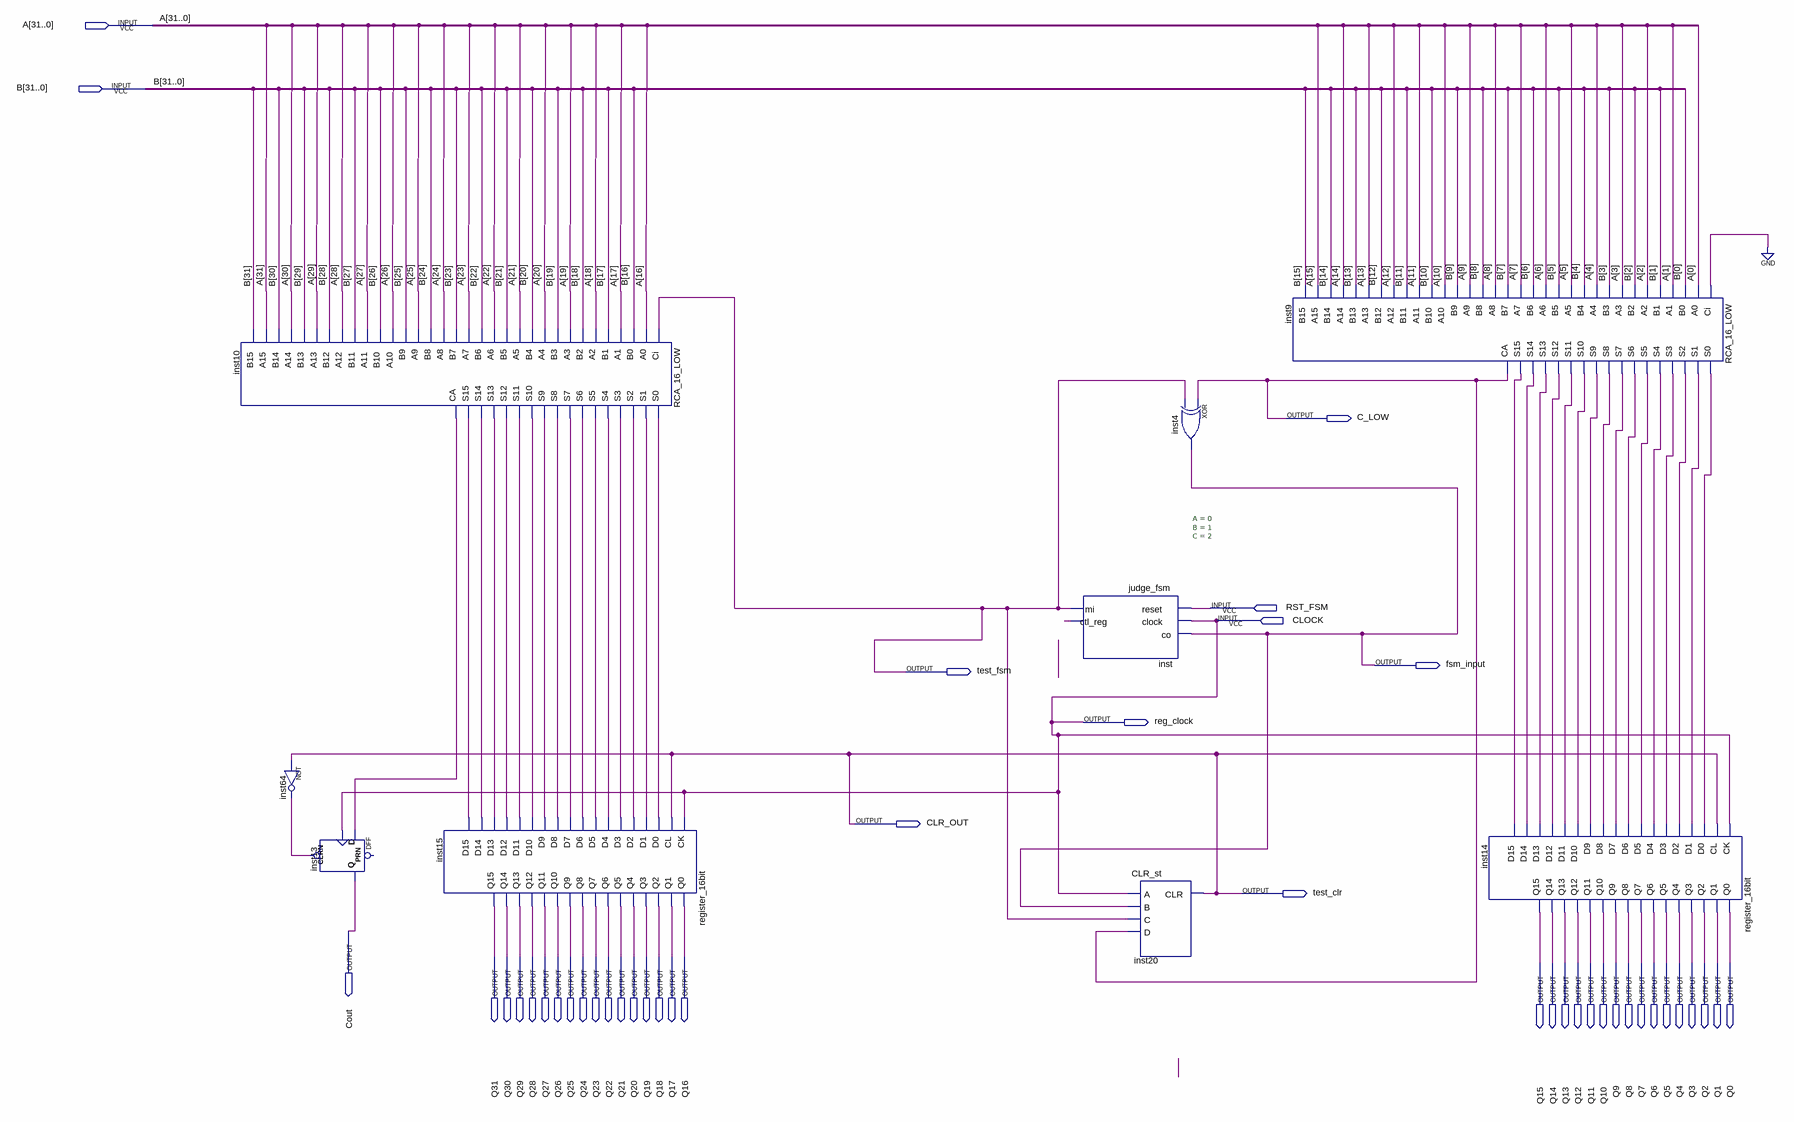
[diagram p0: schematic sheet]
// Quartus schematic final_test.bdf as structural Verilog: 9 symbols, 43 pins
module final_test (
  input  [31:0] A,
  input  [31:0] B,
  input  RST_FSM,
  input  CLOCK,
  output C_LOW,
  output fsm_input,
  output test_fsm,
  output reg_clock,
  output CLR_OUT,
  output test_clr,
  output Cout,
  output Q31,
  output Q30,
  output Q29,
  output Q28,
  output Q27,
  output Q26,
  output Q25,
  output Q24,
  output Q23,
  output Q22,
  output Q21,
  output Q20,
  output Q19,
  output Q18,
  output Q17,
  output Q16,
  output Q15,
  output Q14,
  output Q13,
  output Q12,
  output Q11,
  output Q10,
  output Q9,
  output Q8,
  output Q7,
  output Q6,
  output Q5,
  output Q4,
  output Q3,
  output Q2,
  output Q1,
  output Q0
);

  wire inst9_s0, inst9_s1, inst9_s2, inst9_s3, inst9_s4, inst9_s5, inst9_s6, inst9_s7, inst9_s8, inst9_s9,
       inst9_s10, inst9_s11, inst9_s12, inst9_s13, inst9_s14, inst9_s15, inst10_ca, inst10_s0, inst10_s1,
       inst10_s2, inst10_s3, inst10_s4, inst10_s5, inst10_s6, inst10_s7, inst10_s8, inst10_s9, inst10_s10,
       inst10_s11, inst10_s12, inst10_s13, inst10_s14, inst10_s15, inst64_out, inst_ctl_reg;

  RCA_16_LOW inst10 (
    .Ci(test_fsm), .A0(A[16]), .B0(B[16]), .A1(A[17]), .B1(B[17]), .A2(A[18]), .B2(B[18]), .A3(A[19]),
    .B3(B[19]), .A4(A[20]), .B4(B[20]), .A5(A[21]), .B5(B[21]), .A6(A[22]), .B6(B[22]), .A7(A[23]),
    .B7(B[23]), .A8(A[24]), .B8(B[24]), .A9(A[25]), .B9(B[25]), .A10(A[26]), .B10(B[26]), .A11(A[27]),
    .B11(B[27]), .A12(A[28]), .B12(B[28]), .A13(A[29]), .B13(B[29]), .A14(A[30]), .B14(B[30]), .A15(A[31]),
    .B15(B[31]), .S0(inst10_s0), .S1(inst10_s1), .S2(inst10_s2), .S3(inst10_s3), .S4(inst10_s4),
    .S5(inst10_s5), .S6(inst10_s6), .S7(inst10_s7), .S8(inst10_s8), .S9(inst10_s9), .S10(inst10_s10),
    .S11(inst10_s11), .S12(inst10_s12), .S13(inst10_s13), .S14(inst10_s14), .S15(inst10_s15), .CA(inst10_ca));
  not inst64 (inst64_out, CLR_OUT);
  DFF inst13 (.CLRN(inst64_out), .CLK(CLOCK), .D(inst10_ca), .Q(Cout));  // open: PRN
  register_16bit inst15 (
    .CK(CLOCK), .CL(CLR_OUT), .D0(inst10_s0), .D1(inst10_s1), .D2(inst10_s2), .D3(inst10_s3), .D4(inst10_s4),
    .D5(inst10_s5), .D6(inst10_s6), .D7(inst10_s7), .D8(inst10_s8), .D9(inst10_s9), .D10(inst10_s10),
    .D11(inst10_s11), .D12(inst10_s12), .D13(inst10_s13), .D14(inst10_s14), .D15(inst10_s15), .Q0(Q16),
    .Q1(Q17), .Q2(Q18), .Q3(Q19), .Q4(Q20), .Q5(Q21), .Q6(Q22), .Q7(Q23), .Q8(Q24), .Q9(Q25), .Q10(Q26),
    .Q11(Q27), .Q12(Q28), .Q13(Q29), .Q14(Q30), .Q15(Q31));
  judge_fsm #(.A(0), .B(1), .C(2)) inst (
    .reset(RST_FSM), .clock(CLOCK), .co(fsm_input), .mi(test_fsm), .ctl_reg(inst_ctl_reg));
  CLR_st inst20 (.A(CLOCK), .B(fsm_input), .C(test_fsm), .D(C_LOW), .CLR(CLR_OUT));
  xor inst4 (fsm_input, C_LOW, test_fsm);
  RCA_16_LOW inst9 (
    .Ci(1'b0), .A0(A[0]), .B0(B[0]), .A1(A[1]), .B1(B[1]), .A2(A[2]), .B2(B[2]), .A3(A[3]), .B3(B[3]),
    .A4(A[4]), .B4(B[4]), .A5(A[5]), .B5(B[5]), .A6(A[6]), .B6(B[6]), .A7(A[7]), .B7(B[7]), .A8(A[8]),
    .B8(B[8]), .A9(A[9]), .B9(B[9]), .A10(A[10]), .B10(B[10]), .A11(A[11]), .B11(B[11]), .A12(A[12]),
    .B12(B[12]), .A13(A[13]), .B13(B[13]), .A14(A[14]), .B14(B[14]), .A15(A[15]), .B15(B[15]), .S0(inst9_s0),
    .S1(inst9_s1), .S2(inst9_s2), .S3(inst9_s3), .S4(inst9_s4), .S5(inst9_s5), .S6(inst9_s6), .S7(inst9_s7),
    .S8(inst9_s8), .S9(inst9_s9), .S10(inst9_s10), .S11(inst9_s11), .S12(inst9_s12), .S13(inst9_s13),
    .S14(inst9_s14), .S15(inst9_s15), .CA(C_LOW));
  register_16bit inst14 (
    .CK(CLOCK), .CL(CLR_OUT), .D0(inst9_s0), .D1(inst9_s1), .D2(inst9_s2), .D3(inst9_s3), .D4(inst9_s4),
    .D5(inst9_s5), .D6(inst9_s6), .D7(inst9_s7), .D8(inst9_s8), .D9(inst9_s9), .D10(inst9_s10),
    .D11(inst9_s11), .D12(inst9_s12), .D13(inst9_s13), .D14(inst9_s14), .D15(inst9_s15), .Q0(Q0), .Q1(Q1),
    .Q2(Q2), .Q3(Q3), .Q4(Q4), .Q5(Q5), .Q6(Q6), .Q7(Q7), .Q8(Q8), .Q9(Q9), .Q10(Q10), .Q11(Q11), .Q12(Q12),
    .Q13(Q13), .Q14(Q14), .Q15(Q15));

  assign reg_clock = CLOCK;
  assign test_clr = CLR_OUT;
endmodule
